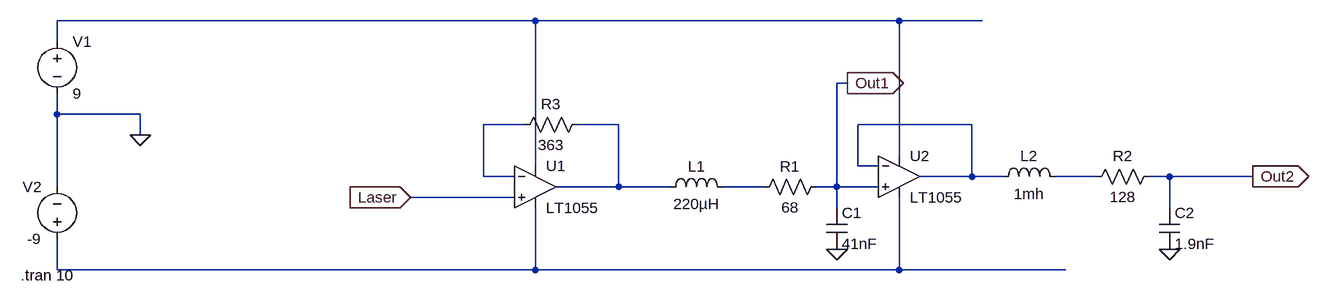
[diagram p0: schematic C1.asc]
C1.asc, the LTspice schematic file:
Version 4
SHEET 1 2020 680
WIRE 800 64 64 64
WIRE 1360 64 800 64
WIRE 1488 64 1360 64
WIRE 64 96 64 64
WIRE 1280 160 1264 160
WIRE 64 208 64 176
WIRE 192 208 64 208
WIRE 784 224 720 224
WIRE 928 224 864 224
WIRE 1472 224 1296 224
WIRE 192 240 192 208
WIRE 1360 272 1360 64
WIRE 800 288 800 64
WIRE 1296 288 1296 224
WIRE 1328 288 1296 288
WIRE 720 304 720 224
WIRE 768 304 720 304
WIRE 1472 304 1472 224
WIRE 1472 304 1392 304
WIRE 1520 304 1472 304
WIRE 1664 304 1600 304
WIRE 1776 304 1744 304
WIRE 1904 304 1776 304
WIRE 64 320 64 208
WIRE 928 320 928 224
WIRE 928 320 832 320
WIRE 1008 320 928 320
WIRE 1152 320 1088 320
WIRE 1264 320 1264 160
WIRE 1264 320 1232 320
WIRE 1328 320 1264 320
WIRE 768 336 608 336
WIRE 1264 352 1264 320
WIRE 1776 352 1776 304
WIRE 64 448 64 400
WIRE 800 448 800 352
WIRE 800 448 64 448
WIRE 1360 448 1360 336
WIRE 1360 448 800 448
WIRE 1616 448 1360 448
FLAG 192 240 0
FLAG 608 336 Laser
IOPIN 608 336 In
FLAG 1264 416 0
FLAG 1776 416 0
FLAG 1904 304 Out2
IOPIN 1904 304 Out
FLAG 1280 160 Out1
IOPIN 1280 160 Out
SYMBOL voltage 64 80 R0
WINDOW 123 0 0 Left 0
WINDOW 39 0 0 Left 0
SYMATTR InstName V1
SYMATTR Value 9
SYMBOL voltage 64 416 R180
WINDOW 0 24 96 Left 2
WINDOW 3 24 16 Left 2
WINDOW 123 0 0 Left 0
WINDOW 39 0 0 Left 0
SYMATTR InstName V2
SYMATTR Value -9
SYMBOL OpAmps\\LT1055 800 256 R0
SYMATTR InstName U1
SYMBOL ind 992 336 R270
WINDOW 0 32 56 VTop 2
WINDOW 3 5 56 VBottom 2
SYMATTR InstName L1
SYMATTR Value 220µH
SYMBOL res 1248 304 R90
WINDOW 0 0 56 VBottom 2
WINDOW 3 32 56 VTop 2
SYMATTR InstName R1
SYMATTR Value 68
SYMBOL cap 1248 352 R0
SYMATTR InstName C1
SYMATTR Value 41nF
SYMBOL OpAmps\\LT1055 1360 240 R0
SYMATTR InstName U2
SYMBOL ind 1504 320 R270
WINDOW 0 32 56 VTop 2
WINDOW 3 5 56 VBottom 2
SYMATTR InstName L2
SYMATTR Value 1mh
SYMBOL res 1760 288 R90
WINDOW 0 0 56 VBottom 2
WINDOW 3 32 56 VTop 2
SYMATTR InstName R2
SYMATTR Value 128
SYMBOL cap 1760 352 R0
SYMATTR InstName C2
SYMATTR Value 1.9nF
SYMBOL res 880 208 R90
WINDOW 0 0 56 VBottom 2
WINDOW 3 32 56 VTop 2
SYMATTR InstName R3
SYMATTR Value 363
TEXT 8 456 Left 2 !.tran 10

The netlist it stands for:
* C1.asc
V1 N001 0 9
V2 N007 0 -9
XU1 Laser N002 N001 N007 N003 LT1055  ; pins In+ In- V+ V- OUT
L1 N003 N006 220µH
R1 Out1 N006 68
C1 Out1 0 41nF
XU2 Out1 N004 N001 N007 N004 LT1055  ; pins In+ In- V+ V- OUT
L2 N004 N005 1mh
R2 Out2 N005 128
C2 Out2 0 1.9nF
R3 N003 N002 363
.tran 10
.backanno
.end